# Altium project CTR-IMU-Board-Rev-A.PrjPcb
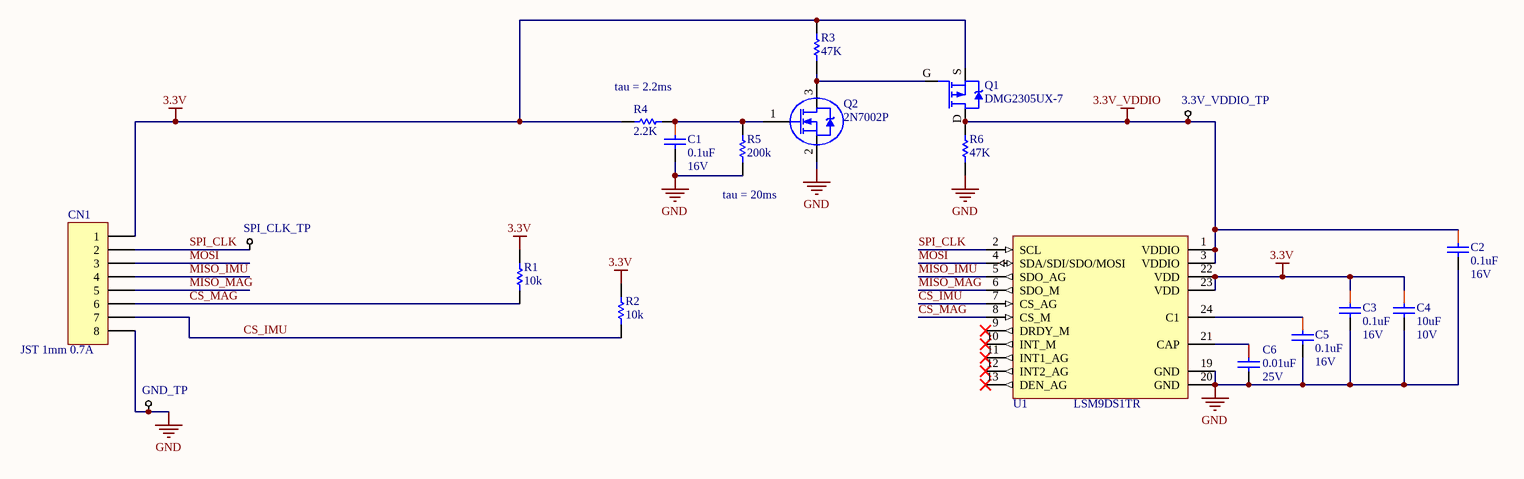
[diagram p0: CTR-IMU-Board-Rev-A.SchDoc]
1 sheet, 19 parts. Net scope: global (net labels, ports and power ports of the same name join across sheets).
Board file: CTR-IMU-Board-Rev-A.PcbDoc

## Sheet CTR-IMU-Board-Rev-A.SchDoc: ZoZbot IMU Board
size B; Author: RMG; Organization: OLogic, Inc.; DocumentNumber: IB1; Revision: A; SheetNumber: 1; SheetTotal: 1; PageSetup: Record=PageOptions|CenterHorizontal=True|CenterVertical=True|PrintScale=0.70|XCorrection=1.00|YCorrection=1.00|PrintKind=0|BorderSize=5000000|LeftOffset=0|BottomOffset=0|Orientation=2|PaperLength=1000|PaperWidth=1000|Scale=100|PaperSource=15|PrintQuality=600|MediaType=1|DitherType=10|PrintScaleMode=1|PaperKind=Letter|PaperIndex=1

### Parts
3.3V_VDDIO_TP  Test Point  [TestPoint-TH 42 mil]  (value not drawn)  (no BOM)
C1  0.1uF  Voltage - Rated: 16V  [CAPC0603(1608)_L]
C2  0.1uF  Voltage - Rated: 16V  [CAPC0603(1608)_L]
C3  0.1uF  Voltage - Rated: 16V  [CAPC0603(1608)_L]
C4  10uF  Voltage - Rated: 10V  [CAPC0805(2012)_L]
C5  0.1uF  Voltage - Rated: 16V  [CAPC0603(1608)_L]
C6  0.01uF  Voltage - Rated: 25V  [CAPC0402(1005)_N]
CN1  JST 1mm 0.7A  [JST-BM08B-SRSS-TB]
GND_TP  Test Point  [TestPoint-TH 42 mil]  (value not drawn)  (no BOM)
Q1  DMG2305UX  [DMG2305UX-7]  (value not drawn)
Q2  2N7002P  [SOT23]
R1  10K  [RESC0402(1005)_N]
R2  10K  [RESC0402(1005)_N]
R3  47K  [RESC0402(1005)_N]
R4  2.2K  [RESC0603(1608)_N]
R5  Resistance (Ohms): 200k  [RESC0402(1005)_N]  (hidden comment: 200K 0402)
R6  47K  [RESC0402(1005)_N]
SPI_CLK_TP  Test Point  [TestPoint-TH 42 mil]  (value not drawn)  (no BOM)
U1  LSM9DS1TR  [LSM9DS1TR]

### Nets
3.3V: C3.1 C4.1 CN1.1 Q1.S R1.2 R2.2 R3.1 R4.2 U1.22(VDD) U1.23(VDD)
3.3V_VDDIO: 3.3V_VDDIO_TP.1 C2.1 Q1.D R6.1 U1.1(VDDIO) U1.3(VDDIO)
GND: C1.2 C2.2 C3.2 C4.2 C5.2 C6.2 CN1.0 CN1.8 GND_TP.1 Q2.2(S) R5.1 R6.2 U1.19(GND) U1.20(GND)
CS_IMU: CN1.7 R2.1 U1.7(CS_AG)
CS_MAG: CN1.6 R1.1 U1.8(CS_M)
MISO_IMU: CN1.4 U1.5(SDO_AG)
MISO_MAG: CN1.5 U1.6(SDO_M)
MOSI: CN1.3 U1.4(SDA/SDI/SDO/MOSI)
SPI_CLK: CN1.2 SPI_CLK_TP.1 U1.2(SCL)
NetC1_1: C1.1 Q2.1(G) R4.1 R5.2
NetC5_1: C5.1 U1.24(C1)
NetC6_1: C6.1 U1.21(CAP)
NetQ1_G: Q1.G Q2.3(D) R3.2

Not connected (* = marked no-connect by the designer): U1 9(DRDY_M)* 10(INT_M)* 11(INT1_AG)* 12(INT2_AG)* 13(DEN_AG)*

### Notes on the sheet
- tau = 2.2ms
- (near R5) tau = 20ms
- Title
- By:
- Date:
- Number:
- Time:
- Revision:
- Sheet
- of
- OLogic, Inc.
- 1394 Borregas Ave.
- Sunnyvale, CA
- 94089 USA
- File:
- (650) 996-1490

### Library data of the parts
3.3V_VDDIO_TP GND_TP SPI_CLK_TP = TestPoint, small
C1-C3 C5 = CAP CER 0.1UF 16V 10% X7R 0603: 0.1uF 0603 16V; Manufacturer: Kemet; Manufacturer Part Number: C0603C104K4RACTU; Capacitance: 0.1µF; Tolerance: ±10%; Temperature Coefficient: X7R; Supplier 1: Digi-Key; RoHS: RoHS Compliant; Category: Capacitors; Stock 1: 2360000; Pricing 1: 4000=0.00414, 8000=0.00378, 12000=0.0036, 28000=0.00342, 100000=0.00248 (USD); Packaging: Tape & Reel (TR); Mounting Type: Surface Mount, MLCC; Operating Temperature: -55°C ~ 125°C; Applications: General Purpose; Ratings: -; Package / Case: 0603 (1608 Metric); Size / Dimension: 0.063" L x 0.031" W (1.60mm x 0.80mm); Height - Seated (Max): -; Thickness (Max): 0.034" (0.87mm); Lead Spacing: -; Features: -; Lead Style: -; ComponentLink1URL: http://www.kemet.com/datasheets&C0603C104K4RACTU; ComponentLink1Description: http://www.kemet.com/datasheets&C0603C104K4RACTU; Supplier Part Number 1: 399-1096-2-ND
C4 = CAP CER 10UF 10V Y5V 0805: 10uF 0805 10V; Manufacturer: Taiyo Yuden; Manufacturer Part Number: LMK212F106ZG-T; Capacitance: 10µF; Tolerance: -20%, +80%; Temperature Coefficient: Y5V (F); Supplier 1: Digi-Key; RoHS: RoHS Compliant; Category: Capacitors; Stock 1: 194456; Pricing 1: 1=0.17, 10=0.115, 50=0.0662, 100=0.0546, 250=0.046, 500=0.03852, 1000=0.03163 (USD); Packaging: Cut Tape (CT); Mounting Type: Surface Mount, MLCC; Operating Temperature: -30°C ~ 85°C; Applications: General Purpose; Ratings: -; Package / Case: 0805 (2012 Metric); Size / Dimension: 0.079" L x 0.049" W (2.00mm x 1.25mm); Height - Seated (Max): -; Thickness (Max): 0.053" (1.35mm); Lead Spacing: -; Features: -; Lead Style: -; ComponentLink1URL: http://www.yuden.co.jp/or/product/category/capacitor/LMK212F106ZG-T.pdf; ComponentLink1Description: http://www.yuden.co.jp/or/product/category/capacitor/LMK212F106ZG-T.pdf; Supplier Part Number 1: 587-1312-1-ND
C6 = CAP CER 0.01UF 25V 10% X5R 0402: 0.01uF 0402; Manufacturer: Murata Electronics North America; Manufacturer Part Number: GRM155R71E103KA01D; Capacitance: 10000pF; Tolerance: ±10%; Temperature Coefficient: X7R; Supplier 1: Digi-Key; RoHS: RoHS Compliant; Category: Capacitors; Stock 1: 4802323; Pricing 1: 1=0.1, 10=0.012, 50=0.0066, 100=0.0057, 250=0.00464, 500=0.00396, 1000=0.00309, 5000=0.00258 (USD); Packaging: Cut Tape (CT); Mounting Type: Surface Mount, MLCC; Operating Temperature: -55°C ~ 125°C; Applications: General Purpose; Ratings: -; Package / Case: 0402 (1005 Metric); Size / Dimension: 0.039" L x 0.020" W (1.00mm x 0.50mm); Height - Seated (Max): -; Thickness (Max): 0.022" (0.55mm); Lead Spacing: -; Features: -; Lead Style: -; ComponentLink1URL: http://www.murata.com/~/media/webrenewal/support/library/catalog/products/capacitor/mlcc/c02e.ashx; ComponentLink1Description: http://www.murata.com/~/media/webrenewal/support/library/catalog/products/capacitor/mlcc/c02e.ashx; Supplier Part Number 1: 490-1312-1-ND
CN1 = JST-BM08B-SRSS-TB(LF)(SN): 1mm Locking Header, 8-Pin; Manufacturer: Japan Solderless Terminals (JST); No of Positions: 8; Style/Orientation: Vertical Header/Plug; Supplier 1: Digikey; Manufacturer Part Number: BM08B-SRSS-TB(LF)(SN); Stock 1: 18919; Pricing 1: 1=0.93, 10=0.814, 100=0.7024, 500=0.5747 (USD); Pitch: 1 mm; Type: Shrouded Header; Termination: Solder; ComponentLink1URL: https://datasheet.ciiva.com/730/esr-730608.pdf; ComponentLink1Description: https://datasheet.ciiva.com/730/esr-730608.pdf; ComponentLink2URL: https://datasheet.ciiva.com/26894/getdatasheetpartid-640965-26894529.pdf; ComponentLink2Description: https://datasheet.ciiva.com/26894/getdatasheetpartid-640965-26894529.pdf; ComponentLink3URL: https://datasheet.ciiva.com/712/esr-712616.pdf; ComponentLink3Description: https://datasheet.ciiva.com/712/esr-712616.pdf; ComponentLink4URL: https://datasheet.ciiva.com/712/esr-712617.pdf; ComponentLink4Description: https://datasheet.ciiva.com/712/esr-712617.pdf; ComponentLink5URL: https://datasheet.ciiva.com/8052/91630-8052091.pdf; ComponentLink5Description: https://datasheet.ciiva.com/8052/91630-8052091.pdf; ComponentLink6URL: https://datasheet.ciiva.com/16380/esr-16380526.pdf; ComponentLink6Description: https://datasheet.ciiva.com/16380/esr-16380526.pdf; Supplier Part Number 1: 455-1794-1-ND
Q1 = DMG2305UX: MOSFET P-CH 20V 4.2A SOT23; Manufacturer: Diodes Incorporated; FET Type: MOSFET P-Channel, Metal Oxide; FET Feature: Standard; Current - Continuous Drain (Id) @ 25°C: 4.2A (Ta); Rds On (Max) @ Id, Vgs: 52 mOhm @ 4.2A, 4.5V; Vgs(th) (Max) @ Id: 900mV @ 250µA; Gate Charge (Qg) @ Vgs: 10.2nC @ 4.5V; Input Capacitance (Ciss) @ Vds: 808pF @ 15V; Power - Max: 1.4W; Supplier 1: Digi-Key; RoHS: RoHS Compliant; Category: Discrete Semiconductor Products; Stock 1: 78669; Pricing 1: 1=0.38, 10=0.311, 100=0.1649, 500=0.10846, 1000=0.0739 (USD); Packaging: Cut Tape (CT); Drain to Source Voltage (Vdss): 20V; Operating Temperature: -55°C ~ 150°C (TJ); Mounting Type: Surface Mount; Package / Case: TO-236-3, SC-59, SOT-23-3; Supplier Device Package: SOT-23; ComponentLink1URL: http://www.diodes.com/_files/datasheets/DMG2305UX.pdf; ComponentLink1Description: http://www.diodes.com/_files/datasheets/DMG2305UX.pdf; Supplier Part Number 1: DMG2305UX-7DICT-ND; Creator: osman; Manufacturer Part Number: DMG2305UX-7
Q2 = 2N7002P: MOSFET N-CH 60V 0.36A SOT-23; Manufacturer: Nexperia USA Inc.; Manufacturer Part Number: 2N7002P,235; FET Type: N-Channel; Current - Continuous Drain (Id) @ 25°C: 360mA (Ta); Drive Voltage (Max Rds On,  Min Rds On): 10V; Vgs(th) (Max) @ Id: 2.4V @ 250µA; Gate Charge (Qg) (Max) @ Vgs: 0.8nC @ 4.5V; Input Capacitance (Ciss) (Max) @ Vds: 50pF @ 10V; Vgs (Max): ±20V; Power Dissipation (Max): 350mW (Ta); Rds On (Max) @ Id, Vgs: 1.6 Ohm @ 500mA, 10V; Supplier 1: Digi-Key; RoHS: RoHS Compliant; Category: Discrete Semiconductor Products; Stock 1: 77037; Pricing 1: 1=0.15, 10=0.135, 100=0.0735, 500=0.04522, 1000=0.03084 (USD); Packaging: Cut Tape (CT); Part Status: Active; Technology: MOSFET (Metal Oxide); Drain to Source Voltage (Vdss): 60V; FET Feature: -; Operating Temperature: -55°C ~ 150°C (TJ); Mounting Type: Surface Mount; Supplier Device Package: TO-236AB (SOT23); Package / Case: TO-236-3, SC-59, SOT-23-3; ComponentLink1URL: http://assets.nexperia.com/documents/data-sheet/2N7002P.pdf; ComponentLink1Description: http://assets.nexperia.com/documents/data-sheet/2N7002P.pdf; Supplier Part Number 1: 1727-1865-1-ND
R1 R2 = RES 10K OHM 1% 1/10W 0402: 10K 0402; Manufacturer: Panasonic Electronic Components; Manufacturer Part Number: ERJ-2RKF1002X; Tolerance: ±1%; Power (Watts): 0.1W, 1/10W; Temperature Coefficient: ±100ppm/°C; Supplier 1: Digi-Key; RoHS: RoHS Compliant; Category: Resistors; Stock 1: 8784573; Pricing 1: 1=0.1, 50=0.0196, 100=0.0149, 250=0.01104, 500=0.00816, 1000=0.00544, 5000=0.00383 (USD); Packaging: Cut Tape (CT); Composition: Thick Film; Features: Automotive AEC-Q200; Operating Temperature: -55°C ~ 155°C; Package / Case: 0402 (1005 Metric); Supplier Device Package: 0402; Size / Dimension: 0.039" L x 0.020" W (1.00mm x 0.50mm); Height: 0.016" (0.40mm); Number of Terminations: 2; ComponentLink1URL: http://industrial.panasonic.com/www-cgi/jvcr13pz.cgi?E+PZ+3+AOA0002+ERJ2RKF1002X+7+WW; ComponentLink1Description: http://industrial.panasonic.com/www-cgi/jvcr13pz.cgi?E+PZ+3+AOA0002+ERJ2RKF1002X+7+WW; Supplier Part Number 1: P10.0KLCT-ND; Creator: osman; Resistance (Ohms): 10k
R3 R6 = RES 47K OHM 5% 1/10W 0402: 47K 0402; Manufacturer: Panasonic Electronic Components; Manufacturer Part Number: ERJ-2GEJ473X; Tolerance: ±5%; Power (Watts): 0.1W, 1/10W; Temperature Coefficient: ±200ppm/°C; Supplier 1: Digi-Key; RoHS: RoHS Compliant; Category: Resistors; Stock 1: 1670564; Pricing 1: 1=0.1, 50=0.0106, 100=0.0078, 250=0.00596, 500=0.00476, 1000=0.0035, 5000=0.00251 (USD); Packaging: Cut Tape (CT); Resistance (Ohms): 47k; Composition: Thick Film; Features: Automotive AEC-Q200; Operating Temperature: -55°C ~ 155°C; Package / Case: 0402 (1005 Metric); Supplier Device Package: 0402; Size / Dimension: 0.039" L x 0.020" W (1.00mm x 0.50mm); Height: 0.016" (0.40mm); Number of Terminations: 2; ComponentLink1URL: http://industrial.panasonic.com/www-cgi/jvcr13pz.cgi?E+PZ+3+AOA0001+ERJ2GEJ473X+7+WW; ComponentLink1Description: http://industrial.panasonic.com/www-cgi/jvcr13pz.cgi?E+PZ+3+AOA0001+ERJ2GEJ473X+7+WW; Supplier Part Number 1: P47KJCT-ND
R4 = RES 2.2K OHM 1/10W 5% 0603 SMD: 2.2K 0603; Manufacturer: Panasonic Electronic Components; Manufacturer Part Number: ERJ-3GEYJ222V; Tolerance: ±5%; Power (Watts): 0.1W, 1/10W; Temperature Coefficient: ±200ppm/°C; Supplier 1: Digi-Key; RoHS: RoHS Compliant; Category: Resistors; Stock 1: 685364; Pricing 1: 1=0.1, 50=0.0126, 100=0.0096, 250=0.00716, 500=0.00528, 1000=0.00352, 2500=0.00297 (USD); Packaging: Cut Tape (CT); Resistance (Ohms): 2.2k; Composition: Thick Film; Features: -; Package / Case: 0603 (1608 Metric); Supplier Device Package: 0603; Size / Dimension: 0.063" L x 0.031" W (1.60mm x 0.80mm); Height: 0.022" (0.55mm); Number of Terminations: 2; ComponentLink1URL: http://industrial.panasonic.com/www-cgi/jvcr13pz.cgi?E+PZ+3+AOA0001+ERJ3GEYJ222V+7+WW; ComponentLink1Description: http://industrial.panasonic.com/www-cgi/jvcr13pz.cgi?E+PZ+3+AOA0001+ERJ3GEYJ222V+7+WW; Supplier Part Number 1: P2.2KGCT-ND
R5 = RES 200K OHM 1% 1/10W 0402: Manufacturer: Panasonic Electronic Components; Manufacturer Part Number: ERJ-2RKF2003X; Tolerance: ±1%; Power (Watts): 0.1W, 1/10W; Temperature Coefficient: ±100ppm/°C; Supplier 1: Digi-Key; RoHS: RoHS Compliant; Category: Resistors; Stock 1: 748497; Pricing 1: 1=0.1, 50=0.0196, 100=0.0149, 250=0.01104, 500=0.00816, 1000=0.00544, 5000=0.00383 (USD); Packaging: Cut Tape (CT); Composition: Thick Film; Features: Automotive AEC-Q200; Operating Temperature: -55°C ~ 155°C; Package / Case: 0402 (1005 Metric); Supplier Device Package: 0402; Size / Dimension: 0.039" L x 0.020" W (1.00mm x 0.50mm); Height: 0.016" (0.40mm); Number of Terminations: 2; ComponentLink1URL: http://industrial.panasonic.com/www-cgi/jvcr13pz.cgi?E+PZ+3+AOA0002+ERJ2RKF2003X+7+WW; ComponentLink1Description: http://industrial.panasonic.com/www-cgi/jvcr13pz.cgi?E+PZ+3+AOA0002+ERJ2RKF2003X+7+WW; Supplier Part Number 1: P200KLCT-ND; Creator: osman
U1 = LSM9DS1TR: IMU ACCEL/GYRO/MAG I2C/SPI; Manufacturer: STMicroelectronics; MEMS Module Function: Tri-Axis Gyroscope, Tri-Axis Accelerometer, Tri-Axis Magnetometer; Supply Voltage Min: 1.9V; Supply Voltage Max: 3.6V; Sensor Case Style: LGA; No. of Pins: 24Pins; Gyroscope Range: ± 245°/s, ± 500°/s, ± 2000°/s; Acceleration Range: ± 2g, ± 4g, ± 8g, ± 16g; SVHC: No SVHC (17-Dec-2015); Supplier 1: Digikey; Manufacturer Part Number: LSM9DS1TR; Stock 1: 0; Pricing 1: 1=6.4, 10=5.751, 100=4.7119 (USD); Packaging: Cut Tape; Product Range: -; MSL: MSL 3 - 168 hours; ComponentLink1URL: http://www.farnell.com/datasheets/2028150.pdf; ComponentLink1Description: http://www.farnell.com/datasheets/2028150.pdf; Supplier Part Number 1: 497-14946-1-ND; Supplier 2: Arrow; Supplier Part Number 2: Dw9V-dRFtYxXmYWZjvwLjPoeKnTN-6QEdPxi3Z94YOo